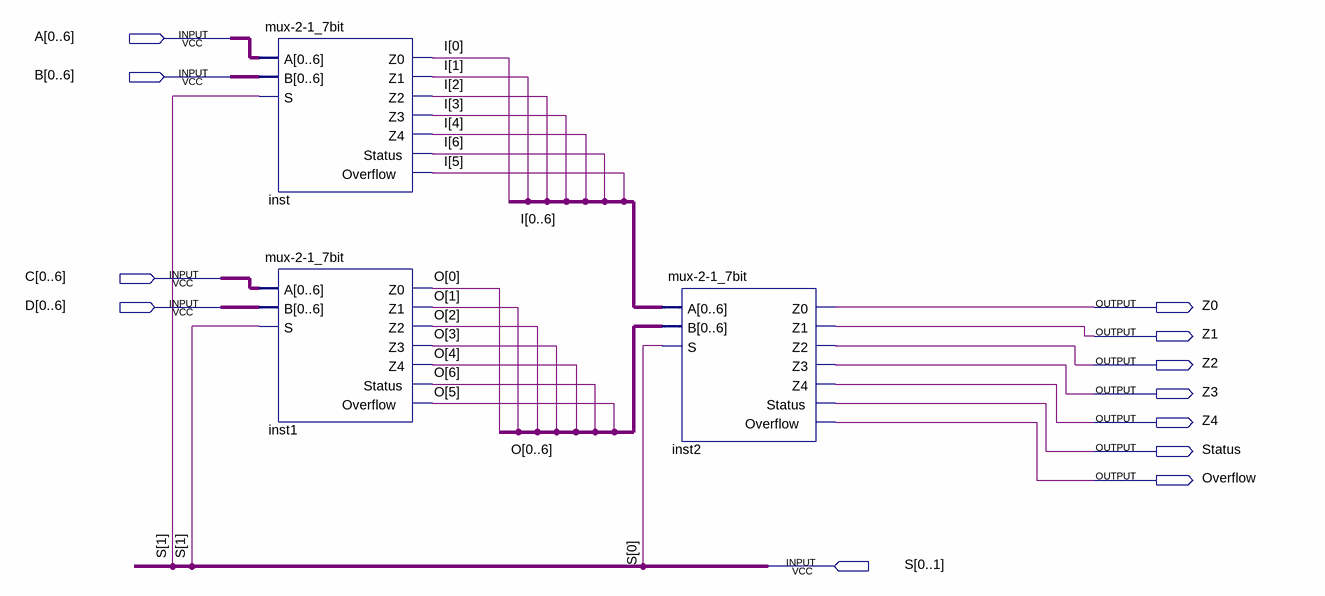
[diagram p0: schematic sheet]
// Quartus schematic mux-4-1_7bit.bdf as structural Verilog: 3 symbols, 12 pins
module \mux-4-1_7bit  (
  input  [0:6] A,
  input  [0:6] B,
  input  [0:6] C,
  input  [0:6] D,
  input  [0:1] S,
  output Z0,
  output Z1,
  output Z2,
  output Z3,
  output Z4,
  output Status,
  output Overflow
);

  wire [6:0] I, O;

  \mux-2-1_7bit  inst (
    .A(A), .B(B), .S(S[1]), .Z0(I[0]), .Z1(I[1]), .Z2(I[2]), .Z3(I[3]), .Z4(I[4]), .Status(I[6]),
    .Overflow(I[5]));
  \mux-2-1_7bit  inst1 (
    .A(C), .B(D), .S(S[1]), .Z0(O[0]), .Z1(O[1]), .Z2(O[2]), .Z3(O[3]), .Z4(O[4]), .Status(O[6]),
    .Overflow(O[5]));
  \mux-2-1_7bit  inst2 (
    .A({I[0], I[1], I[2], I[3], I[4], I[5], I[6]}), .B({O[0], O[1], O[2], O[3], O[4], O[5], O[6]}), .S(S[0]),
    .Z0(Z0), .Z1(Z1), .Z2(Z2), .Z3(Z3), .Z4(Z4), .Status(Status), .Overflow(Overflow));
endmodule
